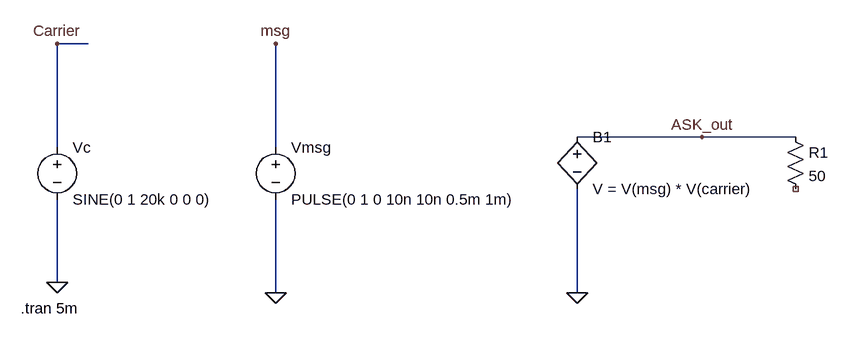
[diagram p0: schematic ASK (exp 10).asc]
ASK (exp 10).asc, the LTspice schematic file:
Version 4.1
SHEET 1 1272 680
WIRE 128 -32 80 -32
WIRE 1072 112 880 112
WIRE 1216 112 1072 112
WIRE 80 128 80 -32
WIRE 416 128 416 -32
WIRE 80 336 80 208
WIRE 416 352 416 208
WIRE 880 352 880 192
FLAG 80 336 0
FLAG 80 -32 Carrier
FLAG 416 352 0
FLAG 416 -32 msg
FLAG 1072 112 ASK_out
FLAG 880 352 0
SYMBOL voltage 80 112 R0
WINDOW 123 0 0 Left 0
WINDOW 39 0 0 Left 0
SYMATTR InstName Vc
SYMATTR Value SINE(0 1 20k 0 0 0)
SYMBOL voltage 416 112 R0
WINDOW 123 0 0 Left 0
WINDOW 39 0 0 Left 0
SYMATTR InstName Vmsg
SYMATTR Value PULSE(0 1 0 10n 10n 0.5m 1m)
SYMBOL bv 880 96 R0
SYMATTR InstName B1
SYMATTR Value V = V(msg) * V(carrier)
SYMBOL res 1200 96 R0
SYMATTR InstName R1
SYMATTR Value 50
TEXT 24 376 Left 2 !.tran 5m

The netlist it stands for:
* ASK (exp 10).asc
Vc Carrier 0 SINE(0 1 20k 0 0 0)
Vmsg msg 0 PULSE(0 1 0 10n 10n 0.5m 1m)
B1 ASK_out 0 V = V(msg) * V(carrier)
R1 ASK_out NC_01 50
.tran 5m
.backanno
.end